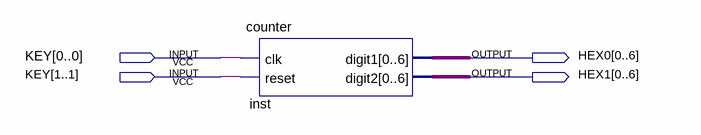
[diagram p0: schematic sheet]
// Quartus schematic counter_ssd.bdf as structural Verilog: 1 symbols, 4 pins
module counter_ssd (
  input  [1:0] KEY,
  output [0:6] HEX0,
  output [0:6] HEX1
);

  counter inst (.clk(KEY[0]), .reset(KEY[1]), .digit1(HEX0), .digit2(HEX1));
endmodule
